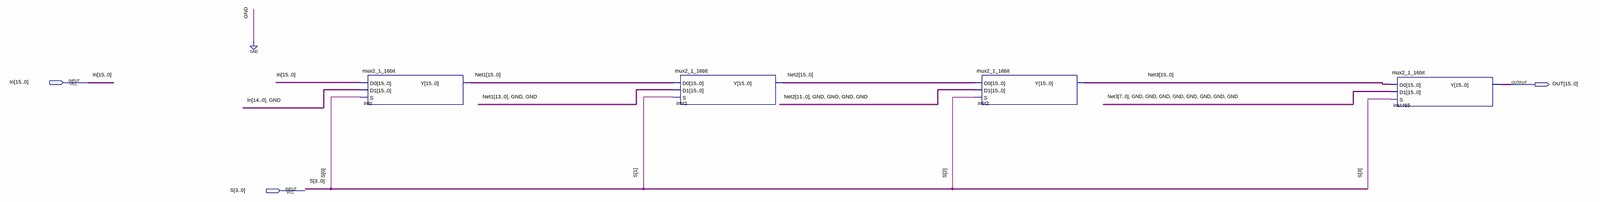
[diagram p0: schematic sheet, whole]
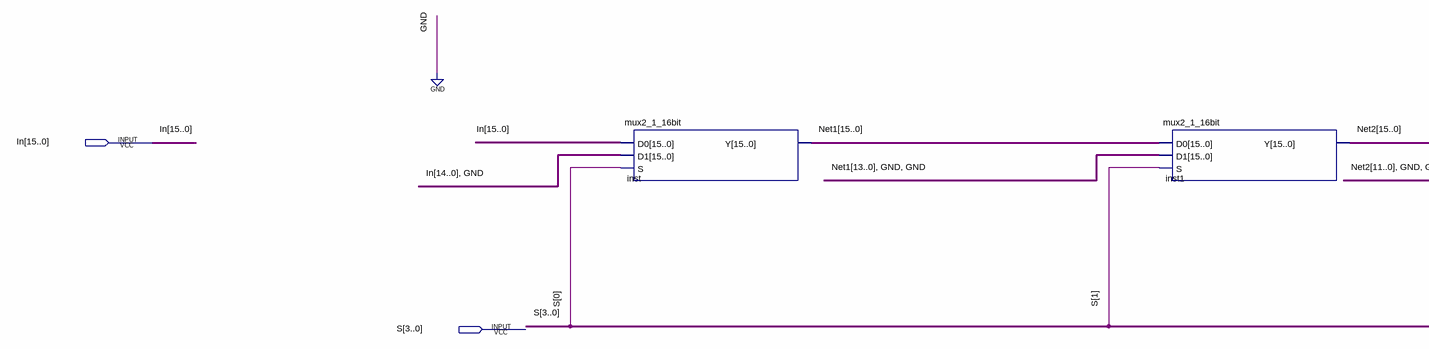
[diagram p1: schematic sheet, left part]
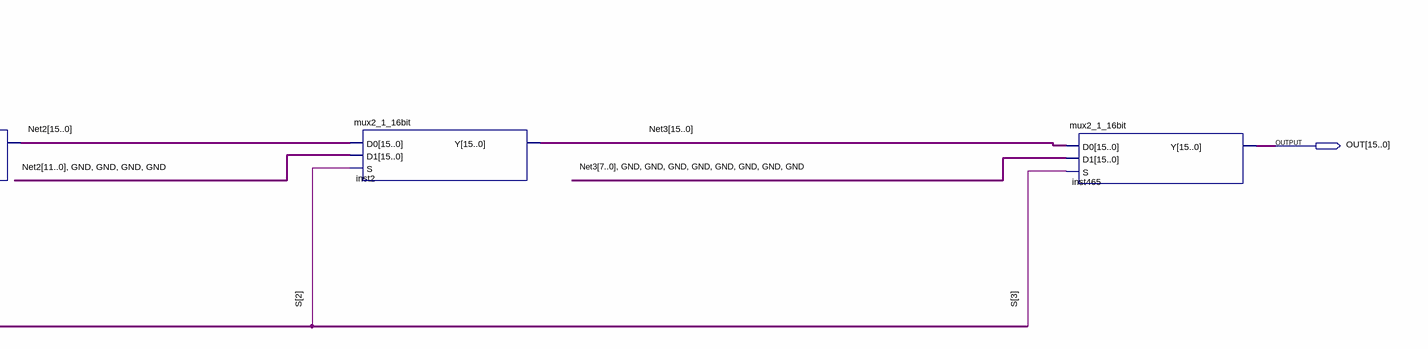
[diagram p2: schematic sheet, right part]
// Quartus schematic Shifter_left.bdf as structural Verilog: 4 symbols, 3 pins
module Shifter_left (
  input  [15:0] In,
  input  [3:0] S,
  output [15:0] OUT
);

  wire [15:0] Net1, Net2, Net3;

  mux2_1_16bit inst (.D0(In), .D1({In[14:0], 1'b0}), .S(S[0]), .Y(Net1));
  mux2_1_16bit inst1 (.D0(Net1), .D1({Net1[13:0], 2'b00}), .S(S[1]), .Y(Net2));
  mux2_1_16bit inst2 (.D0(Net2), .D1({Net2[11:0], 4'b0000}), .S(S[2]), .Y(Net3));
  mux2_1_16bit inst465 (.D0(Net3), .D1({Net3[7:0], {8{1'b0}}}), .S(S[3]), .Y(OUT));
endmodule
